# EAGLE design NextTouch (EAGLE 7.3.0)
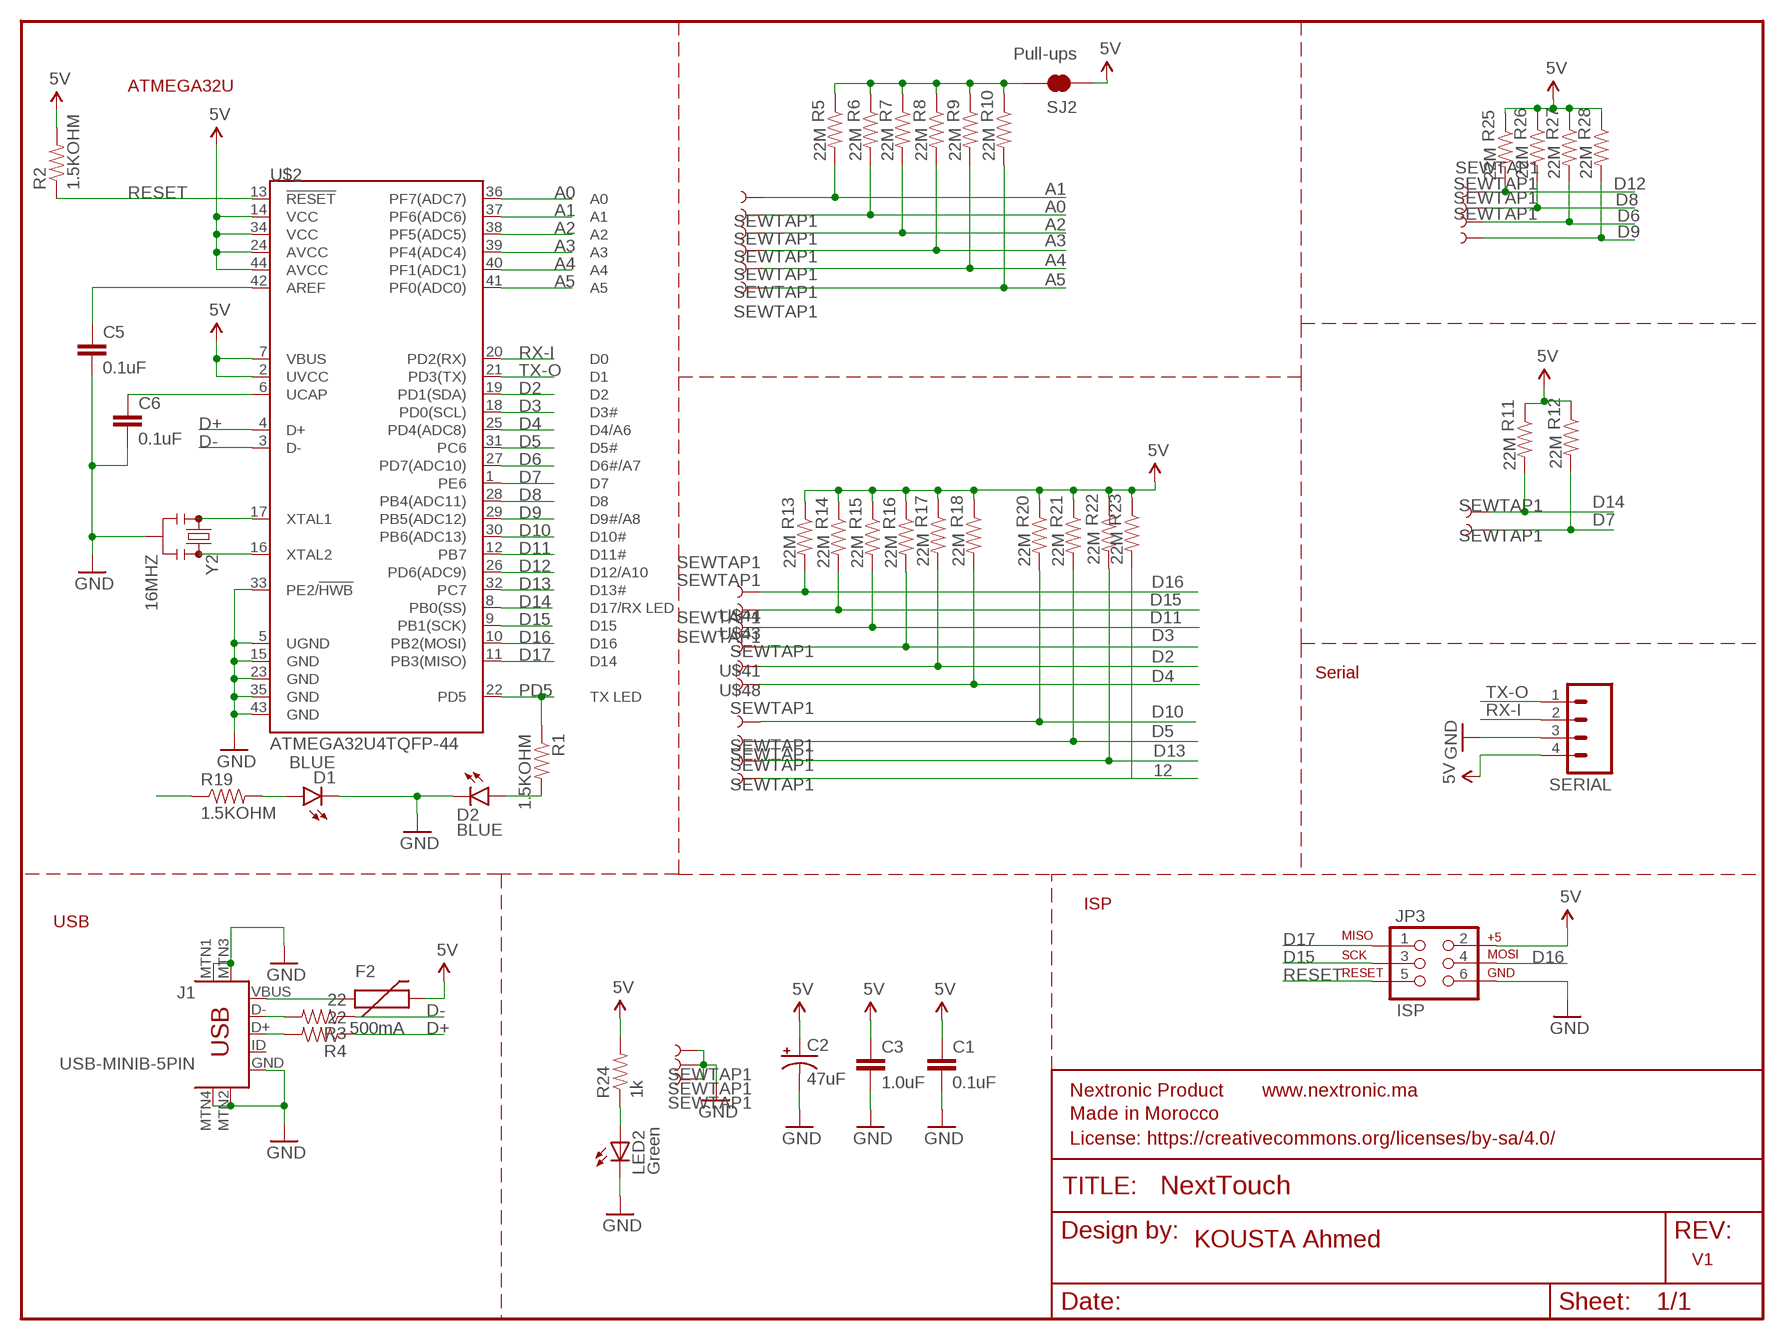
[diagram p0: schematic, sheet 1]

## Parts
C1  0.1uF  CAP0603  [0603]
C2  47uF  CAP_POL3528  [EIA3528]
C3  1.0uF  CAP0603  [0603]
C5  0.1uF  0.18UF-10V(+-10%)(0603)  [0603]
C6  0.1uF  0.18UF-10V(+-10%)(0603)  [0603]
D1  BLUE  LED-BLUE1206  [LED-1206]
D2  BLUE  LED-BLUE1206  [LED-1206]
F2  500mA  PTCSMD  [PTC-1206]
FRAME1  FRAME-LETTER  [CREATIVE_COMMONS]
GND  SEWTAP1  [PETAL-LONG-1]
J1  USB-MINIB-5PIN  [USB-MINIB]
JP3  ISP  AVR_SPI_PRG_6NS  [2X3-NS]
LED2  Green  LED1206-NS  [LED-1206-NO_SILK]
R1  1.5KOHM  1.5KOHM-1/10W-1%(0603)  [0603]
R2  1.5KOHM  1.5KOHM-1/10W-1%(0603)  [0603]
R3  22  1.5KOHM-1/10W-1%(0603)  [0603]
R4  22  1.5KOHM-1/10W-1%(0603)  [0603]
R5  22M  1.5KOHM-1/10W-1%(0603)  [0603]
R6  22M  1.5KOHM-1/10W-1%(0603)  [0603]
R7  22M  1.5KOHM-1/10W-1%(0603)  [0603]
R8  22M  1.5KOHM-1/10W-1%(0603)  [0603]
R9  22M  1.5KOHM-1/10W-1%(0603)  [0603]
R10  22M  1.5KOHM-1/10W-1%(0603)  [0603]
R11  22M  1.5KOHM-1/10W-1%(0603)  [0603]
R12  22M  1.5KOHM-1/10W-1%(0603)  [0603]
R13  22M  1.5KOHM-1/10W-1%(0603)  [0603]
R14  22M  1.5KOHM-1/10W-1%(0603)  [0603]
R15  22M  1.5KOHM-1/10W-1%(0603)  [0603]
R16  22M  1.5KOHM-1/10W-1%(0603)  [0603]
R17  22M  1.5KOHM-1/10W-1%(0603)  [0603]
R18  22M  1.5KOHM-1/10W-1%(0603)  [0603]
R19  1.5KOHM  1.5KOHM-1/10W-1%(0603)  [0603]
R20  22M  1.5KOHM-1/10W-1%(0603)  [0603]
R21  22M  1.5KOHM-1/10W-1%(0603)  [0603]
R22  22M  1.5KOHM-1/10W-1%(0603)  [0603]
R23  22M  1.5KOHM-1/10W-1%(0603)  [0603]
R24  1k  RESISTOR0603-RES  [0603-RES]
R25  22M  1.5KOHM-1/10W-1%(0603)  [0603]
R26  22M  1.5KOHM-1/10W-1%(0603)  [0603]
R27  22M  1.5KOHM-1/10W-1%(0603)  [0603]
R28  22M  1.5KOHM-1/10W-1%(0603)  [0603]
SERIAL  M04PTH  [1X04]
SJ2  Pull-ups  SOLDERJUMPER-OLDTRACE  [SJ_2S-TRACE]
U$2  ATMEGA32U4TQFP-44  [TQFP44]
U$3  SEWTAP1  [PETAL-LONG-1]
U$4  SEWTAP1  [PETAL-LONG-1]
U$5  SEWTAP1  [PETAL-LONG-1]
U$6  SEWTAP1  [PETAL-LONG-1]
U$7  SEWTAP1  [PETAL-LONG-1]
U$30  SEWTAP1  [PETAL-LONG-1]
U$31  SEWTAP1  [PETAL-LONG-1]
U$32  SEWTAP1  [PETAL-LONG-1]
U$33  SEWTAP1  [PETAL-LONG-1]
U$34  SEWTAP1  [PETAL-LONG-1]
U$35  SEWTAP1  [PETAL-LONG-1]
U$36  SEWTAP1  [PETAL-LONG-1]
U$37  SEWTAP1  [PETAL-LONG-1]
U$38  SEWTAP1  [PETAL-LONG-1]
U$39  SEWTAP1  [PETAL-LONG-1]
U$40  SEWTAP1  [PETAL-LONG-1]
U$41  SEWTAP1  [PETAL-LONG-1]
U$42  SEWTAP1  [PETAL-LONG-1]
U$43  SEWTAP1  [PETAL-LONG-1]
U$44  SEWTAP1  [PETAL-LONG-1]
U$45  SEWTAP1  [PETAL-LONG-1]
U$46  SEWTAP1  [PETAL-LONG-1]
U$48  SEWTAP1  [PETAL-LONG-1]
U$51  SEWTAP1  [PETAL-LONG-1]
Y2  16MHZ  RESONATOR16MHZ  [RESONATOR-SMD]

## Nets
5V: C1.1 C2.A(+) C3.1 F2.2 JP3.2 R2.2 R11.1 R12.1 R13.1 R14.1 R15.1 R16.1 R17.1 R18.1 R20.1 R21.1 R22.1 R23.1 R24.2 R25.1 R26.1 R27.1 R28.1 SERIAL.4 SJ2.1 U$2.2(UVCC) U$2.7(VBUS) U$2.14(VCC) U$2.24(AVCC) U$2.34(VCC) U$2.44(AVCC)
12: R23.2 U$51.1
A0: R6.2 U$2.36(PF7(ADC7)) U$40.1
A1: R5.2 U$2.37(PF6(ADC6)) U$4.1
A2: R7.2 U$2.38(PF5(ADC5)) U$31.1
A3: R8.2 U$2.39(PF4(ADC4)) U$32.1
A4: R9.2 U$2.40(PF1(ADC1)) U$33.1
A5: R10.2 U$2.41(PF0(ADC0)) U$34.1
D2: R17.2 U$2.19(PD1(SDA)) U$48.1
D3: R16.2 U$2.18(PD0(SCL)) U$41.1
D4: R18.2 U$2.25(PD4(ADC8)) U$35.1
D5: R21.2 U$2.31(PC6) U$38.1
D6: R27.2 U$2.27(PD7(ADC10)) U$7.1
D7: R12.2 U$2.1(PE6) U$46.1
D8: R26.2 U$2.28(PB4(ADC11)) U$6.1
D9: R28.2 U$2.29(PB5(ADC12)) U$3.1
D10: R20.2 U$2.30(PB6(ADC13)) U$37.1
D11: R15.2 U$2.12(PB7) U$42.1
D12: R25.2 U$2.26(PD6(ADC9)) U$5.1
D13: R22.2 U$2.32(PC7) U$39.1
D14: R11.2 U$2.8(PB0(SS)) U$45.1
D15: JP3.3 R14.2 U$2.9(PB1(SCK)) U$43.1
D16: JP3.4 R13.2 U$2.10(PB2(MOSI)) U$44.1
D17: JP3.1 R19.1 U$2.11(PB3(MISO))
D+: R4.1 U$2.4(D+)
D-: R3.1 U$2.3(D-)
GND [vcc]: C1.2 C2.C(-) C3.2 C5.2 C6.2 D1.C D2.C GND.1 J1.GND J1.MTN1(MTN2) J1.MTN2(MTN3) J1.MTN3(MTN1) J1.MTN4 JP3.6 LED2.C SERIAL.3 U$2.5(UGND) U$2.15(GND) U$2.23(GND) U$2.33(PE2/!HWB) U$2.35(GND) U$2.43(GND) U$30.1 U$36.1 Y2.2
N$1: D2.A R1.2
N$2: LED2.A R24.1
N$3: D1.A R19.2
N$4: U$2.17(XTAL1) Y2.1
N$5: U$2.16(XTAL2) Y2.3
N$6: C5.1 U$2.42(AREF)
N$9: R5.1 R6.1 R7.1 R8.1 R9.1 R10.1 SJ2.2
N$13: F2.1 J1.VBUS
N$14: C6.1 U$2.6(UCAP)
N$15: J1.D- R3.2
N$16: J1.D+ R4.2
PD5: R1.1 U$2.22(PD5)
RESET: JP3.5 R2.1 U$2.13(!RESET)
RX-I: SERIAL.2 U$2.20(PD2(RX))
TX-O: SERIAL.1 U$2.21(PD3(TX))
Unconnected: J1.ID

## Notes on the sheet
- ATMEGA32U
- Serial
- ISP
- USB
- KOUSTA Ahmed
- V1

## Library data of the parts
C1 C3 = SparkFun:CAP: Capacitor Standard 0603 ceramic capacitor, and 0.1" leaded capacitor.; OC_FARNELL: unknown
C2 = SparkFun:CAP_POL: Capacitor Polarized These are standard SMD and PTH capacitors. Normally 10uF, 47uF, and 100uF in electrolytic and tantalum varieties. Always verify the external diameter of the through hole cap, it varies with capacity, voltage, and manufacturer. The EIA devices should be standard.; OC_FARNELL: unknown
C5 C6 = SparkFun-Capacitors:0.18UF-10V(+-10%)(0603); OC_FARNELL: unknown; PROD_ID: CAP-12380
D1 D2 = SparkFun-LED:LED-BLUE: Blue LEDs for production use Various blue LEDs stocked by SparkFun production 0603 - DIO-08575 Rebel - DIO-09553 1206 - DIO-09911; OC_FARNELL: unknown; PROD_ID: DIO-09911
F2 = SparkFun-PowerIC:PTC: Resettable Fuse PTC Resettable Fuse. Spark Fun Electronics SKU : COM-08357; OC_FARNELL: unknown; PROD_ID: RES-11150
FRAME1 = SparkFun-Aesthetics:FRAME-LETTER: Schematic Frame Standard 8.5x11 US Letter frame
GND U$3-U$7 U$30-U$46 U$48 U$51 = LilyPad-Wearables:SEWTAP: Sew Taps for LilyPad Boards.; OC_FARNELL: unknown
J1 = SparkFun-Connectors:USB-MINIB: Mini-USB "B" connector with 5th pin broken out. Created new symbol breaking out 5th "ID" pin in mini/micro USB connector spec. See: http://en.wikipedia.org/wiki/Mini_usb#Cables. Uses same footprint as 4-pin symbol. Also added pins to connect to mounting / shield pads if required (probably not generally needed as signals aren't shielded once they leave the connector).; OC_FARNELL: unknown; PROD_ID: CONN-08193
JP3 = SparkFun:AVR_SPI_PRG_6: AVR ISP 6 Pin This is the reduced ISP connector for AVR programming. Common on Arduino. This footprint will take up less PCB space and can be used with a 10-pin to 6-pin adapter such as SKU: BOB-08508; OC_FARNELL: unknown
LED2 = SparkFun-LED:LED: LEDs Standard schematic elements and footprints for 5mm, 3mm, 1206, and 0603 sized LEDs. 5mm - Spark Fun Electronics SKU : COM-00529 (and others); OC_FARNELL: unknown
R1 R2 R19 = SparkFun-Resistors:1.5KOHM-1/10W-1%(0603): RES-08306; OC_FARNELL: unknown; PROD_ID: RES-08306
R3-R18 R20-R23 R25-R28 = SparkFun-Resistors:1.5KOHM-1/10W-1%(0603): RES-08306; OC_FARNELL: unknown; PROD_ID: RES-08306; VALUE: 1.5KOHM
R24 = SparkFun:RESISTOR: Resistor Basic schematic elements and footprints for 0603, 1206, and PTH resistors.; OC_FARNELL: unknown
SERIAL = SparkFun-Connectors:M04: Header 4 Standard 4-pin 0.1" header. Use with straight break away headers (SKU : PRT-00116), right angle break away headers (PRT-00553), swiss pins (PRT-00743), machine pins (PRT-00117), and female headers (PRT-00115). Molex polarized connector foot print use with SKU : PRT-08231 with associated crimp pins and housings. 1MM SMD Version SKU: PRT-10208; OC_FARNELL: unknown; PROD_ID: CONN-09696
SJ2 = SparkFun:SOLDERJUMPER-OLD: Solder Jumper Standard SMD solder jumper. Used to automate production. Two varients : Normally Open and Normally Closed are the same, but have different paste layers. NC will have a large amount of paste and should jumper during reflow.; OC_FARNELL: unknown
U$2 = SparkFun-DigitalIC:ATMEGA32U4: Atmel 44-pin 8-bit Microcontroller with 32KBytes of ISP Flash and USB Controller; OC_FARNELL: unknown
Y2 = SparkFun-FreqCtrl:RESONATOR: Resonator Small SMD resonator. Used, eg, on the Arduino Pro/ Pro Mini boards. 8MHz- XTAL-08895 16MHz- XTAL-08900; OC_FARNELL: unknown; PROD_ID: XTAL-08900

## Net classes
0 default: width 0.152 mm, drill 0.305 mm, clearance 0.152 mm

## Board
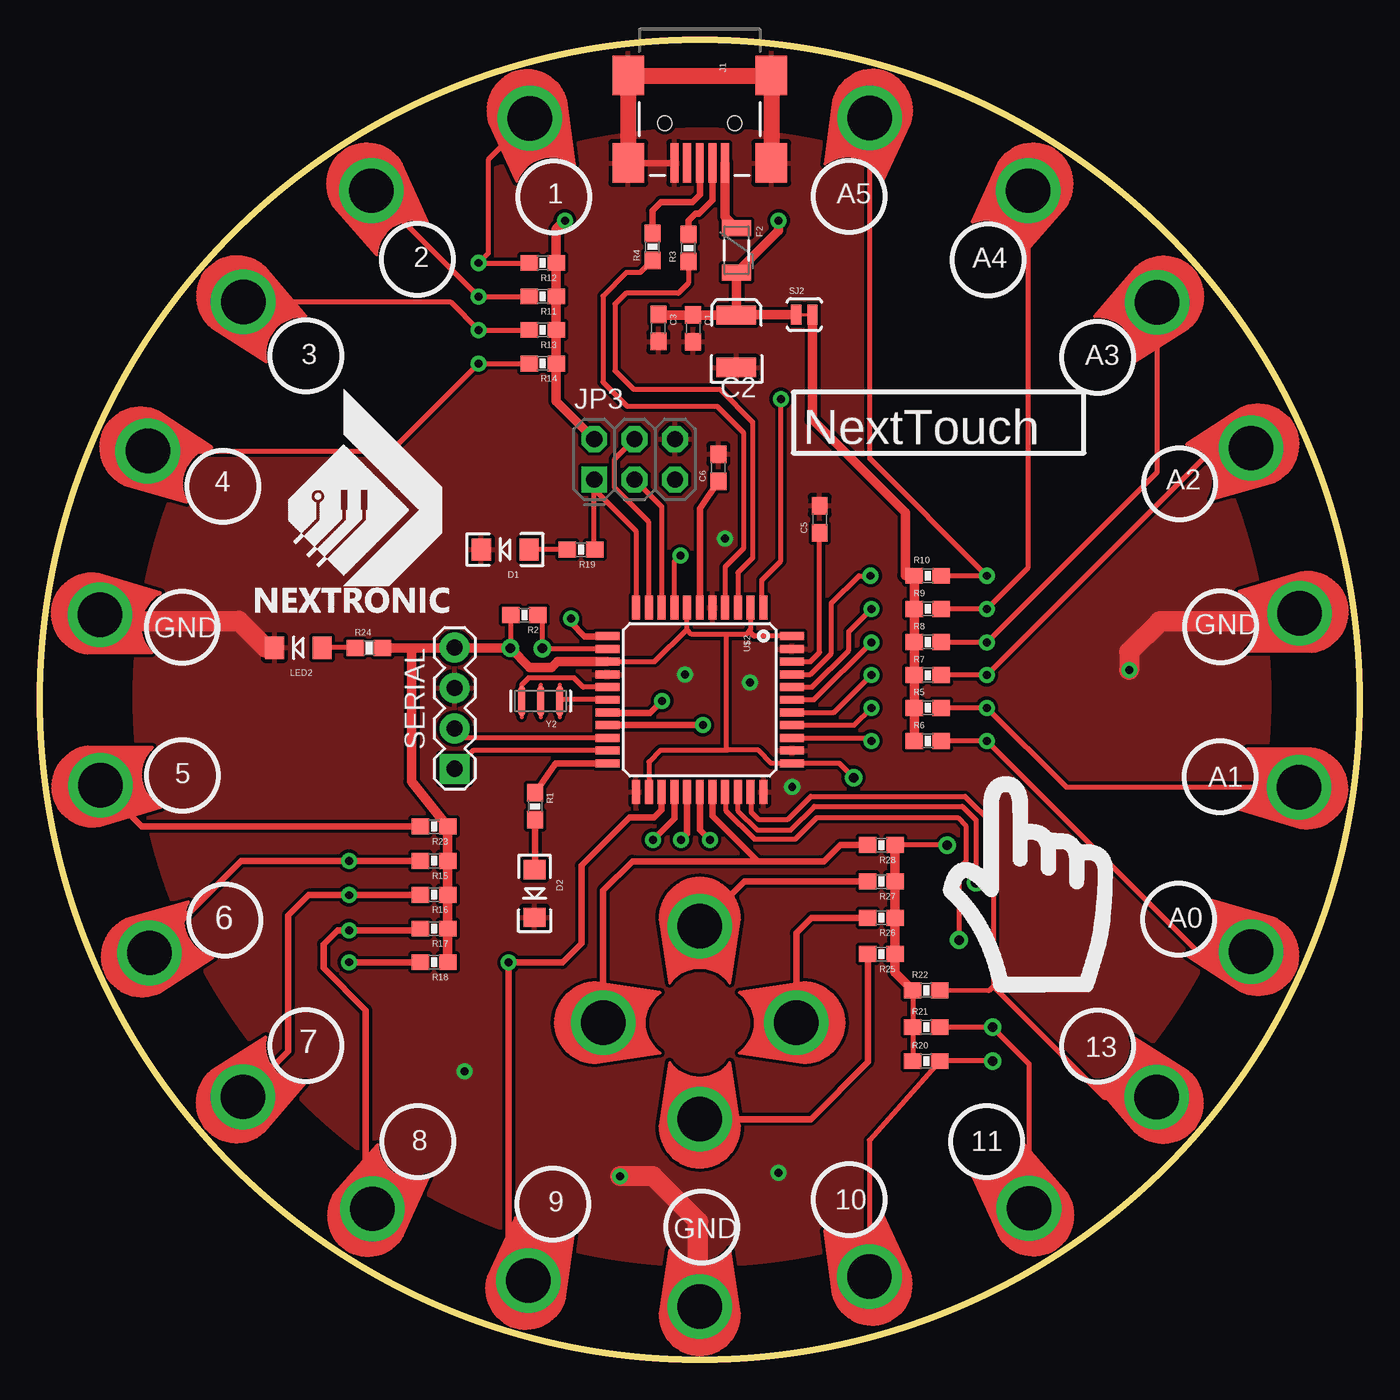
[diagram p1: board, top side]
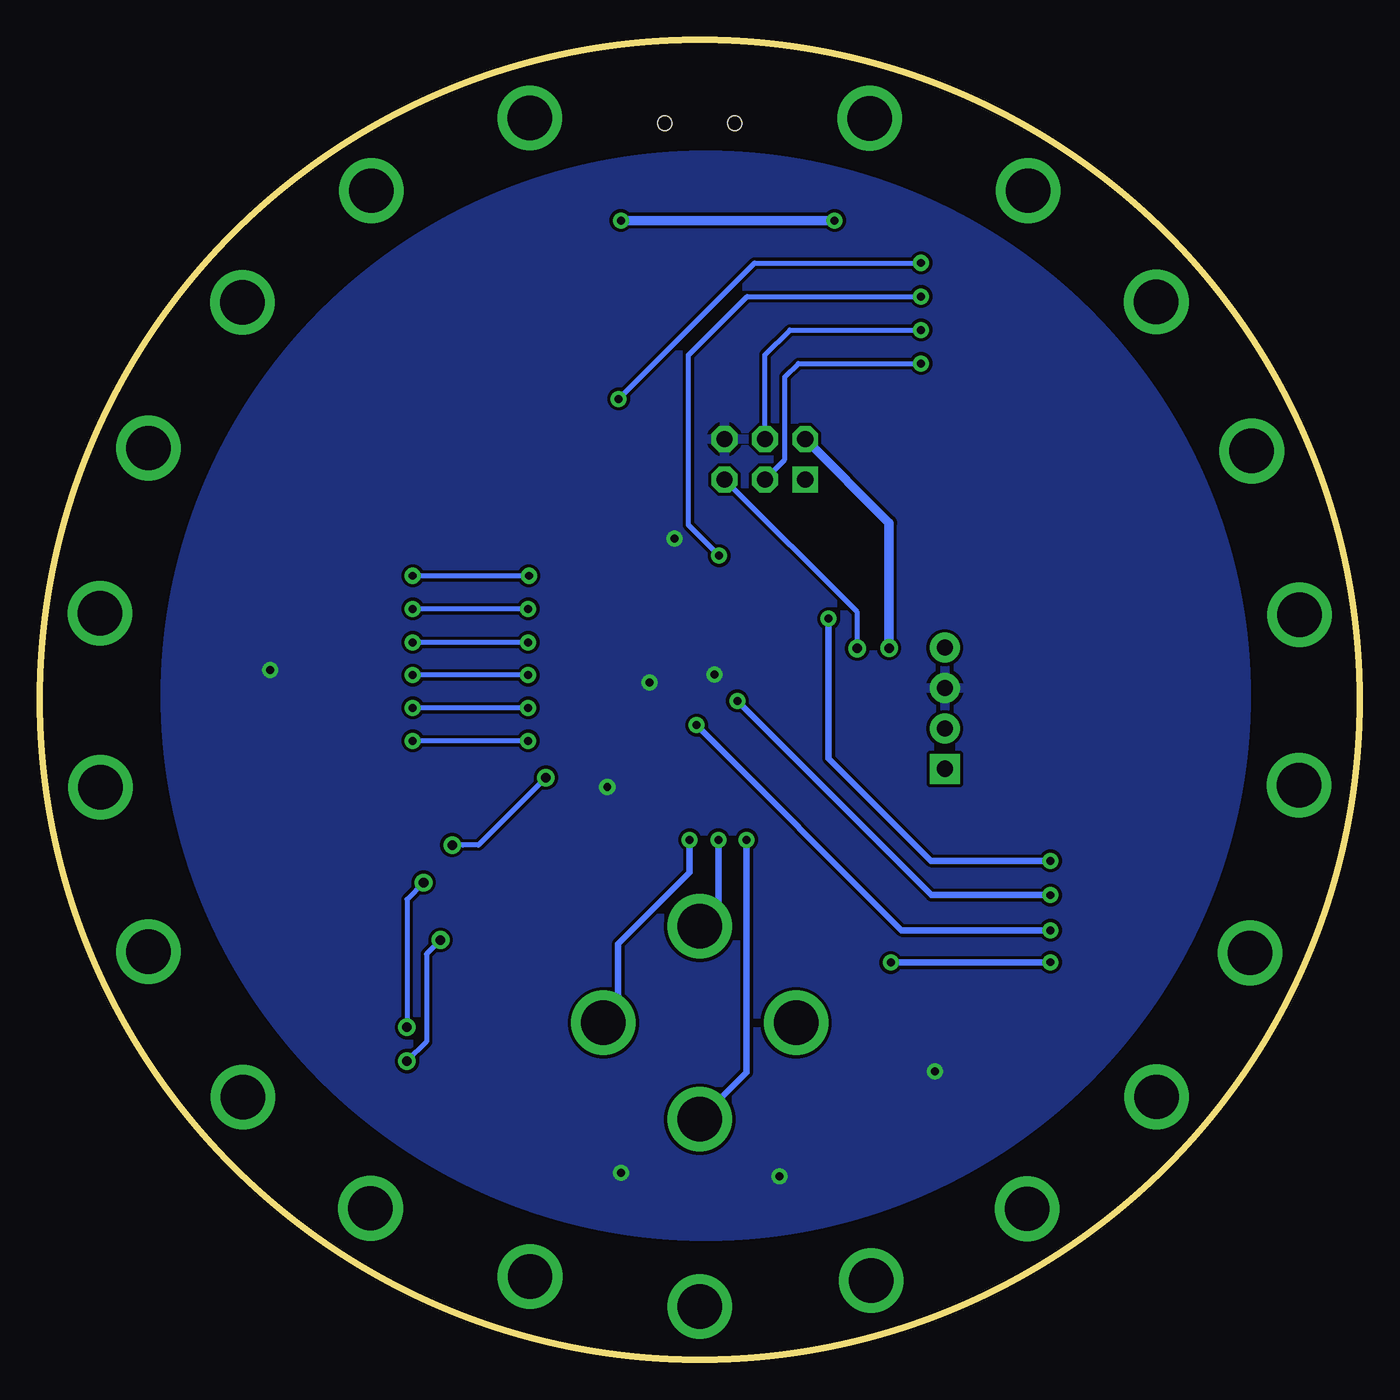
[diagram p2: board, bottom side, seen from below]

Size 83.05 x 83.05 mm. Coordinates in mm from the lower left corner, seen from the top.
Outline: circle at 41.52,41.52 radius 41.52
Copper layers (1*16): Top 0.035mm / dielectric 1.5mm / Bottom 0.035mm
Design rules "SparkFun": minimum track width 8mil, minimum drill 20mil, track to track 8mil, track to pad 8mil, pad to pad 8mil, via to via 8mil, smd to smd 8mil, copper to edge 10mil, drill to drill 8mil, minimum pad ring 12mil, minimum via ring 10mil, stop-mask expansion 4mil, vias tented up to drill 20mil, thermal gap 10mil
tRestrict: area 3.6,3.6 to 79.8,79.8
bRestrict: area 3.1,3.7 to 79.3,79.9

### Footprints (pad centres in the part's own frame; a part is rotated, then mirrored left to right if it is on the bottom)
0603 = smd 1.1 x 1: 1 -0.85,0; 2 0.85,0
EIA3528 = smd 1.2 x 2.5: A 1.65,0; C -1.65,0
LED-1206 = smd 1.2 x 1.4: A -1.5,0; C 1.5,0
PTC-1206 = smd 1 x 1.8: 1 -1.4,0; 2 1.4,0
PETAL-LONG-1 = drill 2.794 pad 4.064: 1 0.03,0
USB-MINIB = smd 2.5 x 0.5: D+ 2.5,0; D- 2.5,0.8; GND 2.5,-1.6; ID 2.5,-0.8; VBUS 2.5,1.6 | smd 2.5 x 2: MTN1 -3,4.5; MTN2 2.5,4.5; MTN3 -3,-4.5; MTN4 2.5,-4.5 | hole 0.9: 0,2.2; 0,-2.2
2X3-NS = drill 1.016 square: 1 -2.54,-1.27 | drill 1.016 octagon: 2 -2.54,1.27; 3 0,-1.27; 4 0,1.27; 5 2.54,-1.27; 6 2.54,1.27
LED-1206-NO_SILK = smd 1.2 x 1.4: A -1.5,0; C 1.5,0
0603-RES = smd 1.1 x 1: 1 -0.85,0; 2 0.85,0
1X04 = drill 1.016 pad 1.88 square: 1 0,0 | drill 1.016 pad 1.88: 2 2.54,0; 3 5.08,0; 4 7.62,0
SJ_2S-TRACE = smd 0.635 x 1.27: 1 -0.508,0; 2 0.508,0
TQFP44 = smd 1.5 x 0.5: 1 -5.8,4; 2 -5.8,3.2; 3 -5.8,2.4; 4 -5.8,1.6; 5 -5.8,0.8; 6 -5.8,0; 7 -5.8,-0.8; 8 -5.8,-1.6; 9 -5.8,-2.4; 10 -5.8,-3.2; 11 -5.8,-4; 23 5.8,-4; 24 5.8,-3.2; 25 5.8,-2.4; 26 5.8,-1.6; 27 5.8,-0.8; 28 5.8,0; 29 5.8,0.8; 30 5.8,1.6; 31 5.8,2.4; 32 5.8,3.2; 33 5.8,4 | smd 0.5 x 1.5: 12 -4,-5.8; 13 -3.2,-5.8; 14 -2.4,-5.8; 15 -1.6,-5.8; 16 -0.8,-5.8; 17 0,-5.8; 18 0.8,-5.8; 19 1.6,-5.8; 20 2.4,-5.8; 21 3.2,-5.8; 22 4,-5.8; 34 4,5.8; 35 3.2,5.8; 36 2.4,5.8; 37 1.6,5.8; 38 0.8,5.8; 39 0,5.8; 40 -0.8,5.8; 41 -1.6,5.8; 42 -2.4,5.8; 43 -3.2,5.8; 44 -4,5.8
RESONATOR-SMD = smd 0.45 x 1.905: 1 -1.2,0; 2 0,0; 3 1.2,0

### Placement (x,y rotation side)
C1  41.1,64.9 270 top
C2  43.83,64.08 90 top
C3  38.92,64.9 270 top
C5  49.07,52.88 90 top
C6  42.69,56.13 90 top
D1  29.28,50.97 180 top
D2  31.13,29.33 270 top
F2  43.83,69.79 270 top
FRAME1  -0.72,-0.27 0 top
GND  3.76,46.87 351.8 top
J1  41.52,77.79 270 top
JP3  37.42,56.65 0 top
LED2  16.28,44.8 180 top
R1  31.16,34.82 270 top
R2  30.5,46.86 180 top
R3  40.81,69.95 90 top
R4  38.55,70.02 90 top
R5  55.87,41.02 0 top
R6  55.87,38.93 0 top
R7  55.87,43.07 0 top
R8  55.87,45.16 0 top
R9  55.87,47.24 0 top
R10  55.87,49.32 0 top
R11  31.64,66.9 180 top
R12  31.64,69.01 180 top
R13  31.64,64.79 180 top
R14  31.64,62.68 180 top
R15  24.81,31.39 180 top
R16  24.81,29.26 180 top
R17  24.81,27.12 180 top
R18  24.81,25.01 180 top
R19  34.06,50.97 180 top
R20  55.77,18.79 0 top
R21  55.77,20.92 0 top
R22  55.77,23.24 0 top
R23  24.81,33.55 180 top
R24  20.72,44.77 0 top
R25  52.95,25.52 180 top
R26  52.95,27.81 180 top
R27  52.95,30.09 180 top
R28  52.95,32.38 180 top
SERIAL  26.11,37.18 90 top
SJ2  48.1,65.75 0 top
U$2  41.52,41.52 270 top
U$3  35.43,21.2 0 top
U$4  79.26,36.02 171.8 top
U$5  41.52,15.11 90 top
U$6  47.62,21.2 180 top
U$7  41.52,27.3 270 top
U$30  79.28,46.98 188.2 top
U$31  76.23,57.37 204.5 top
U$32  70.32,66.55 220.9 top
U$33  62.2,73.58 237.3 top
U$34  52.23,78.15 253.7 top
U$35  30.74,4.95 73.7 top
U$36  41.52,3.31 90 top
U$37  52.21,5.2 106.3 top
U$38  62.25,9.5 122.7 top
U$39  70.29,16.49 139.1 top
U$40  76.22,25.67 155.5 top
U$41  12.75,16.52 40.9 top
U$42  6.87,25.58 24.5 top
U$43  6.77,57.18 335.5 top
U$44  12.78,66.58 319.1 top
U$45  20.85,73.58 302.7 top
U$46  30.82,78.14 286.3 top
U$48  20.92,9.47 57.3 top
U$51  3.8,36.14 8.2 top
Y2  31.52,41.45 180 top

### Tracks (layer width: path | path; a pad name or v marks a point on that pad's centre or on a via)
5V  (via drill 0.5, 0.6)
  Top 0.305: U$2.2 44.72,45.94 44.62,45.84 | 44.62,45.84 44.42,45.64 43.17,45.61 | 43.17,45.61 41.02,45.64 40.71,45.94 | 40.71,45.94 U$2.7 | U$2.44 45.18,45.52 | 45.18,45.52 44.94,45.52 44.62,45.84 | U$2.14 38.69,43.92 40.71,45.94 | U$2.34 46.03,37.52 45.21,38.35 43.25,38.35 | 45.21,45.5 45.18,45.52 | U$2.24 38.32,37.61 39.06,38.35 43.25,38.35 | U$2.24 | U$2.34 47.34,37.51 | v57.09,32.38 R28.1 | R22.1 R21.1 R20.1 | v51.2,36.62 50.3,37.52 U$2.34 | 43.17,45.61 43.17,38.42 43.25,38.35 | R2.2 29.61,46.82 v29.61,44.77
  Top 0.61: 43.84,65.74 F2.2 46.48,71.04 v46.48,71.67 | 43.84,65.74 C2.A 41.12,65.73 | 41.12,65.73 C1.1 | 41.12,65.73 38.94,65.73 C3.1 | U$2.14 32.57,43.92 32.2,43.56 30.83,43.56 v29.61,44.77 26.11,44.77 | R28.1 R27.1 R26.1 R25.1 53.8,24.35 R22.1 | 43.84,65.74 47.58,65.74 SJ2.1 | R18.1 R17.1 R16.1 R15.1 R23.1 23.39,36.37 23.39,44.77 | v33.04,71.67 32.49,71.12 R12.1 R11.1 R13.1 R14.1 32.49,60.31 JP3.2 | R24.2 23.39,44.77 | 23.39,44.77 26.11,44.77 | 26.11,44.77 SERIAL.4
  Bottom 0.305: 56.43,32.38 v57.09,32.38 55.44,32.38 v51.2,36.62
  Bottom 0.61: v29.61,44.77 29.61,52.65 JP3.2 | v33.04,71.67 v46.48,71.67
12
  Top 0.406: R23.2 6.42,33.55 U$51.1
A0  (via drill 0.5)
  Top 0.305: U$40.1 72.83,25.68 v59.58,38.93 R6.2 | U$2.36 52.1,39.12 v52.32,38.93
  Bottom 0.305: v52.32,38.93 v59.58,38.93
A1  (via drill 0.5)
  Top 0.305: U$4.1 64.57,36.02 v59.58,41.02 R5.2 | U$2.37 51.23,39.92 v52.32,41.02
  Bottom 0.305: v52.32,41.02 v59.58,41.02
A2  (via drill 0.5)
  Top 0.305: 74.5,57.36 U$31.1 73.87,57.36 v59.58,43.07 R7.2 | U$2.38 49.97,40.72 v52.32,43.07
  Bottom 0.305: v52.32,43.07 v59.58,43.07
A3  (via drill 0.5)
  Top 0.305: U$32.1 70.3,55.84 v59.58,45.13 57.3,45.13 R8.2 | U$2.39 48.71,41.52 v52.32,45.13
  Bottom 0.305: v52.32,45.13 v59.58,45.13
A4  (via drill 0.5)
  Top 0.305: U$33.1 62.19,49.84 v59.58,47.24 R9.2 | U$2.40 48.6,42.32 50.9,44.62 50.9,45.82 v52.32,47.24
  Bottom 0.305: v52.32,47.24 v59.58,47.24
A5  (via drill 0.5)
  Top 0.305: U$2.41 48.48,43.12 49.8,44.44 49.8,47.59 51.53,49.32 v52.27,49.32 | U$34.1 52.22,56.68 v59.58,49.32 R10.2
  Bottom 0.305: v52.27,49.32 v59.58,49.32
D2  (via drill 0.5)
  Top 0.406: U$2.19 | U$2.19 v41.73,39.92 | R17.2 23.31,27.02 v19.45,27.02 18.74,27.02 17.85,26.13 17.85,24.66 20.52,21.99 20.52,9.91 U$48.1
  Bottom 0.406: v41.73,39.92 28.82,27.02 v19.45,27.02
D3  (via drill 0.5)
  Top 0.406: U$2.18 35.76,40.69 38.4,40.69 v39.16,41.45 | R16.2 23.39,29.23 v19.45,29.23 16.91,29.23 15.64,27.96 15.64,19.4 U$41.1
  Bottom 0.406: v39.16,41.45 26.94,29.23 v19.45,29.23
D4  (via drill 0.5)
  Top 0.406: U$2.25 39.12,34.58 38.65,34.11 37.1,34.11 34.08,31.08 34.08,26.18 32.89,24.99 v29.51,24.99 29.51,6.21 U$35.1 | v19.45,25.01 R18.2
  Bottom 0.406: v29.51,24.99 29.48,25.01 v19.45,25.01
D5  (via drill 0.6)
  Top 0.305: U$2.31 43.91,34.56 45.16,33.32 47.24,33.32 48.74,34.82 58.03,34.82 58.9,33.95 v58.9,30.02 | R21.2 v59.94,20.92 62.23,18.63 U$38.1
  Bottom 0.305: v59.94,20.92 59.94,28.98 v58.9,30.02
D6  (via drill 0.5)
  Top 0.406: U$2.27 40.72,33.08 v40.36,32.71 | R27.2 44.35,30.09 U$7.1
  Bottom 0.406: v40.36,32.71 40.36,28.44 U$7.1
D7  (via drill 0.5)
  Top 0.305: U$2.1 45.44,47.41 45.44,49.07 46.63,50.26 v46.63,60.45 | R12.2 v27.6,69.01 28.21,69.61 28.21,75.49 U$46.1
  Bottom 0.305: v27.6,69.01 38.07,69.01 v46.63,60.45
D8  (via drill 0.5)
  Top 0.406: U$2.28 41.52,33.34 v42.16,32.71 | R26.2 48.56,27.81 47.59,26.84 U$6.1
  Bottom 0.406: v42.16,32.71 42.16,30.65 46.65,26.16 46.65,22.14 U$6.1
D9
  Top 0.406: U$3.1 35.45,29.53 37.28,31.36 45.18,31.36 | U$2.29 42.32,34.22 45.18,31.36 | 45.18,31.36 49.35,31.36 50.36,32.38 R28.2
D10  (via drill 0.6)
  Top 0.305: U$2.30 43.15,35.7 43.15,34.56 44.95,32.76 47.54,32.76 48.89,34.11 57.75,34.11 58.26,33.6 58.26,31.34 57.83,30.91 v57.83,26.41 | U$37.1 52.2,13.81 R20.2 v59.94,18.79
  Bottom 0.305: v57.83,26.41 58.72,25.52 58.72,20.01 v59.94,18.79
D11  (via drill 0.5)
  Top 0.406: U$2.12 34.28,45.51 33.42,46.37 v33.42,46.63 | R15.2 v19.45,31.39 12.69,31.39 U$42.1
  Bottom 0.406: v33.42,46.63 33.42,37.84 26.97,31.39 v19.45,31.39
D12  (via drill 0.5)
  Top 0.406: U$2.26 39.92,34.06 v38.58,32.71 | U$5.1 48.51,15.13 52.1,18.73 R25.2
  Bottom 0.406: v38.58,32.71 38.58,18.08 U$5.1
D13
  Top 0.305: U$2.32 44.75,35.7 44.75,34.46 45.21,34 47.06,34 48.51,35.45 58.21,35.45 59.99,33.67 59.99,23.49 | 59.99,23.49 59.71,23.21 R22.2 | 59.99,23.49 66.97,16.51 U$39.1
D14  (via drill 0.5)
  Top 0.305: U$2.8 39.92,50.21 v40.3,50.59 | R11.2 v27.6,66.9 20.95,73.55 U$45.1
  Bottom 0.305: v40.3,50.59 42.23,52.52 42.23,63.21 38.55,66.9 v27.6,66.9
D15  (via drill 0.5)
  Top 0.305: JP3.3 39.12,53.68 U$2.9 | U$43.1 22.09,57.17 v27.6,62.68 R14.2
  Bottom 0.305: JP3.3 36.16,56.64 36.16,61.84 35.33,62.68 v27.6,62.68
D16  (via drill 0.5)
  Top 0.305: U$2.10 38.32,52.7 36.16,54.86 36.16,56.66 JP3.4 | R13.2 v27.6,64.79 25.83,66.56 U$44.1
  Bottom 0.305: JP3.4 37.42,63.22 35.86,64.79 v27.6,64.79
D17
  Top 0.305: U$2.11 37.51,47.34 37.51,52.14 34.88,54.77 JP3.1 34.88,50.99 R19.1
D+
  Top 0.305: U$2.4 | U$2.4 43.12,49.88 44.27,51.02 44.27,58.34 42.62,59.99 36.95,59.99 35.43,61.51 35.43,66.92 36.9,68.4 37.78,68.4 R4.1
D-
  Top 0.305: 43.94,47.34 U$2.3 43.92,49.51 44.85,50.44 44.85,59 42.79,61.06 37.36,61.06 36.19,62.22 36.19,66.42 36.88,67.1 40.18,67.1 40.81,67.74 R3.1
GND  (via drill 0.5)
  Top 0.406: J1.GND J1.MTN4
  Top 1.016: J1.MTN4 J1.MTN3 J1.MTN1 | 46.15,80.79 J1.MTN1 | J1.MTN1 J1.MTN2
  Top 1.27: GND.1 4.19,46.48 12.54,46.48 14.22,44.8 LED2.C | U$30.1 78.74,46.45 70.45,46.45 68.55,44.55 v68.55,43.4 | U$36.1 41.42,3.44 41.42,8.71 38.58,11.55 v36.52,11.55
  other vias: 43.12,51.66 44.67,42.62 26.72,18.13 46.48,11.75 40.61,43.12 47.34,36.04
  pour Bottom: 3.27,82.9 78.48,82.9 79.75,3.3 4.54,3.3
  pour Top: 4.36,82.26 80.16,82.26 80.16,4.57 4.36,4.57
N$1
  Top 0.406: R1.2 31.16,30.86 D2.A
N$2
  Top 0.305: R24.1 19.85,44.8 LED2.A
N$3
  Top 0.305: R19.2 D1.A
N$4
  Top 0.305: U$2.17 32.79,41.52 Y2.1
N$5
  Top 0.305: U$2.16 34.2,42.32 33.62,42.89 30.75,42.89 30.32,42.46
N$6
  Top 0.305: U$2.42 48.5,43.92 49.07,44.5 C5.1
N$9
  Top 0.61: SJ2.2 48.61,59.15 54.45,53.31 54.45,49.34 R10.1 R9.1 R8.1 R7.1 R5.1 R6.1
N$13
  Top 0.61: J1.VBUS 43.12,71.9 F2.1
N$14
  Top 0.406: C6.1 41.52,53.56 U$2.6
N$15
  Top 0.406: J1.D- 42.32,72.96 41.47,72.1 41.24,72.1 40.81,71.67 R3.2
N$16
  Top 0.406: J1.D+ 41.52,73.3 41.07,72.84 39.09,72.84 38.55,72.31 R4.2
PD5
  Top 0.406: U$2.22 32.47,37.52 R1.1
RESET  (via drill 0.6)
  Top 0.305: U$2.13 31.64,44.72 v31.62,44.75 31.62,46.59 R2.1
  Bottom 0.305: v31.62,44.75 31.62,47.03 JP3.5
RX-I
  Top 0.305: U$2.20 26.7,39.12 SERIAL.2
TX-O
  Top 0.305: U$2.21 27.25,38.32 SERIAL.1

### Text on the board
tPlace: 1 | A5 | 2 | A4 | 3 | A3 | NextTouch | 4 | A2 | GND | GND | 5 | A1 | 6 | A0 | 7 | 13 | 8 | 11 | 9 | 10 | GND